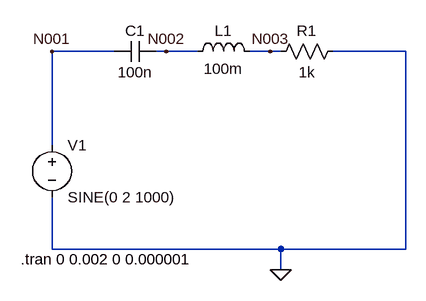
[diagram p0: schematic RLC_series.asc]
RLC_series.asc, the LTspice schematic file:
Version 4
SHEET 1 880 680
WIRE 160 -16 64 -16
WIRE 240 -16 224 -16
WIRE 288 -16 240 -16
WIRE 400 -16 368 -16
WIRE 416 -16 400 -16
WIRE 608 -16 496 -16
WIRE 64 128 64 -16
WIRE 64 288 64 208
WIRE 416 288 64 288
WIRE 608 288 608 -16
WIRE 608 288 416 288
WIRE 416 320 416 288
FLAG 64 -16 N001
FLAG 416 320 0
FLAG 240 -16 N002
FLAG 400 -16 N003
SYMBOL voltage 64 112 R0
WINDOW 123 0 0 Left 0
WINDOW 39 0 0 Left 0
SYMATTR InstName V1
SYMATTR Value SINE(0 2 1000)
SYMBOL res 512 -32 R90
WINDOW 0 0 56 VBottom 2
WINDOW 3 32 56 VTop 2
SYMATTR InstName R1
SYMATTR Value 1k
SYMBOL ind 272 0 R270
WINDOW 0 32 56 VTop 2
WINDOW 3 5 56 VBottom 2
SYMATTR InstName L1
SYMATTR Value 100m
SYMBOL cap 224 -32 R90
WINDOW 0 0 32 VBottom 2
WINDOW 3 32 32 VTop 2
SYMATTR InstName C1
SYMATTR Value 100n
TEXT 16 304 Left 2 !.tran 0 0.002 0 0.000001

The netlist it stands for:
* RLC_series.asc
V1 N001 0 SINE(0 2 1000)
R1 0 N003 1k
L1 N002 N003 100m
C1 N002 N001 100n
.tran 0 0.002 0 0.000001
.backanno
.end